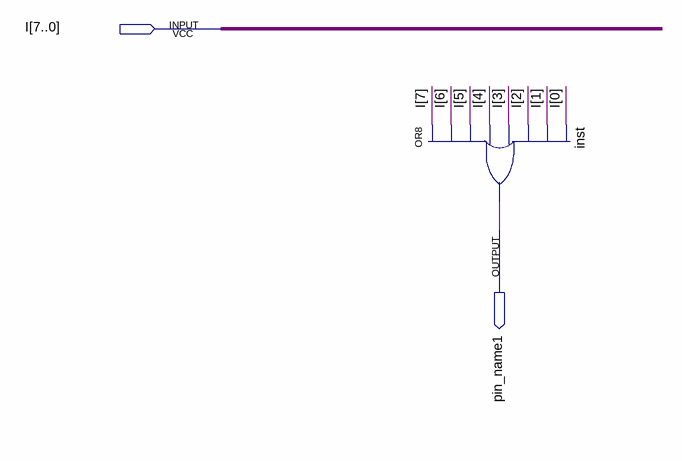
[diagram p0: schematic sheet]
// Quartus schematic Checkbit1.bdf as structural Verilog: 1 symbols, 2 pins
module Checkbit1 (
  input  [7:0] I,
  output pin_name1
);

  or inst (pin_name1, I[7], I[6], I[5], I[4], I[3], I[2], I[1], I[0]);
endmodule
